# EAGLE design biertemp (EAGLE 6.5.0)
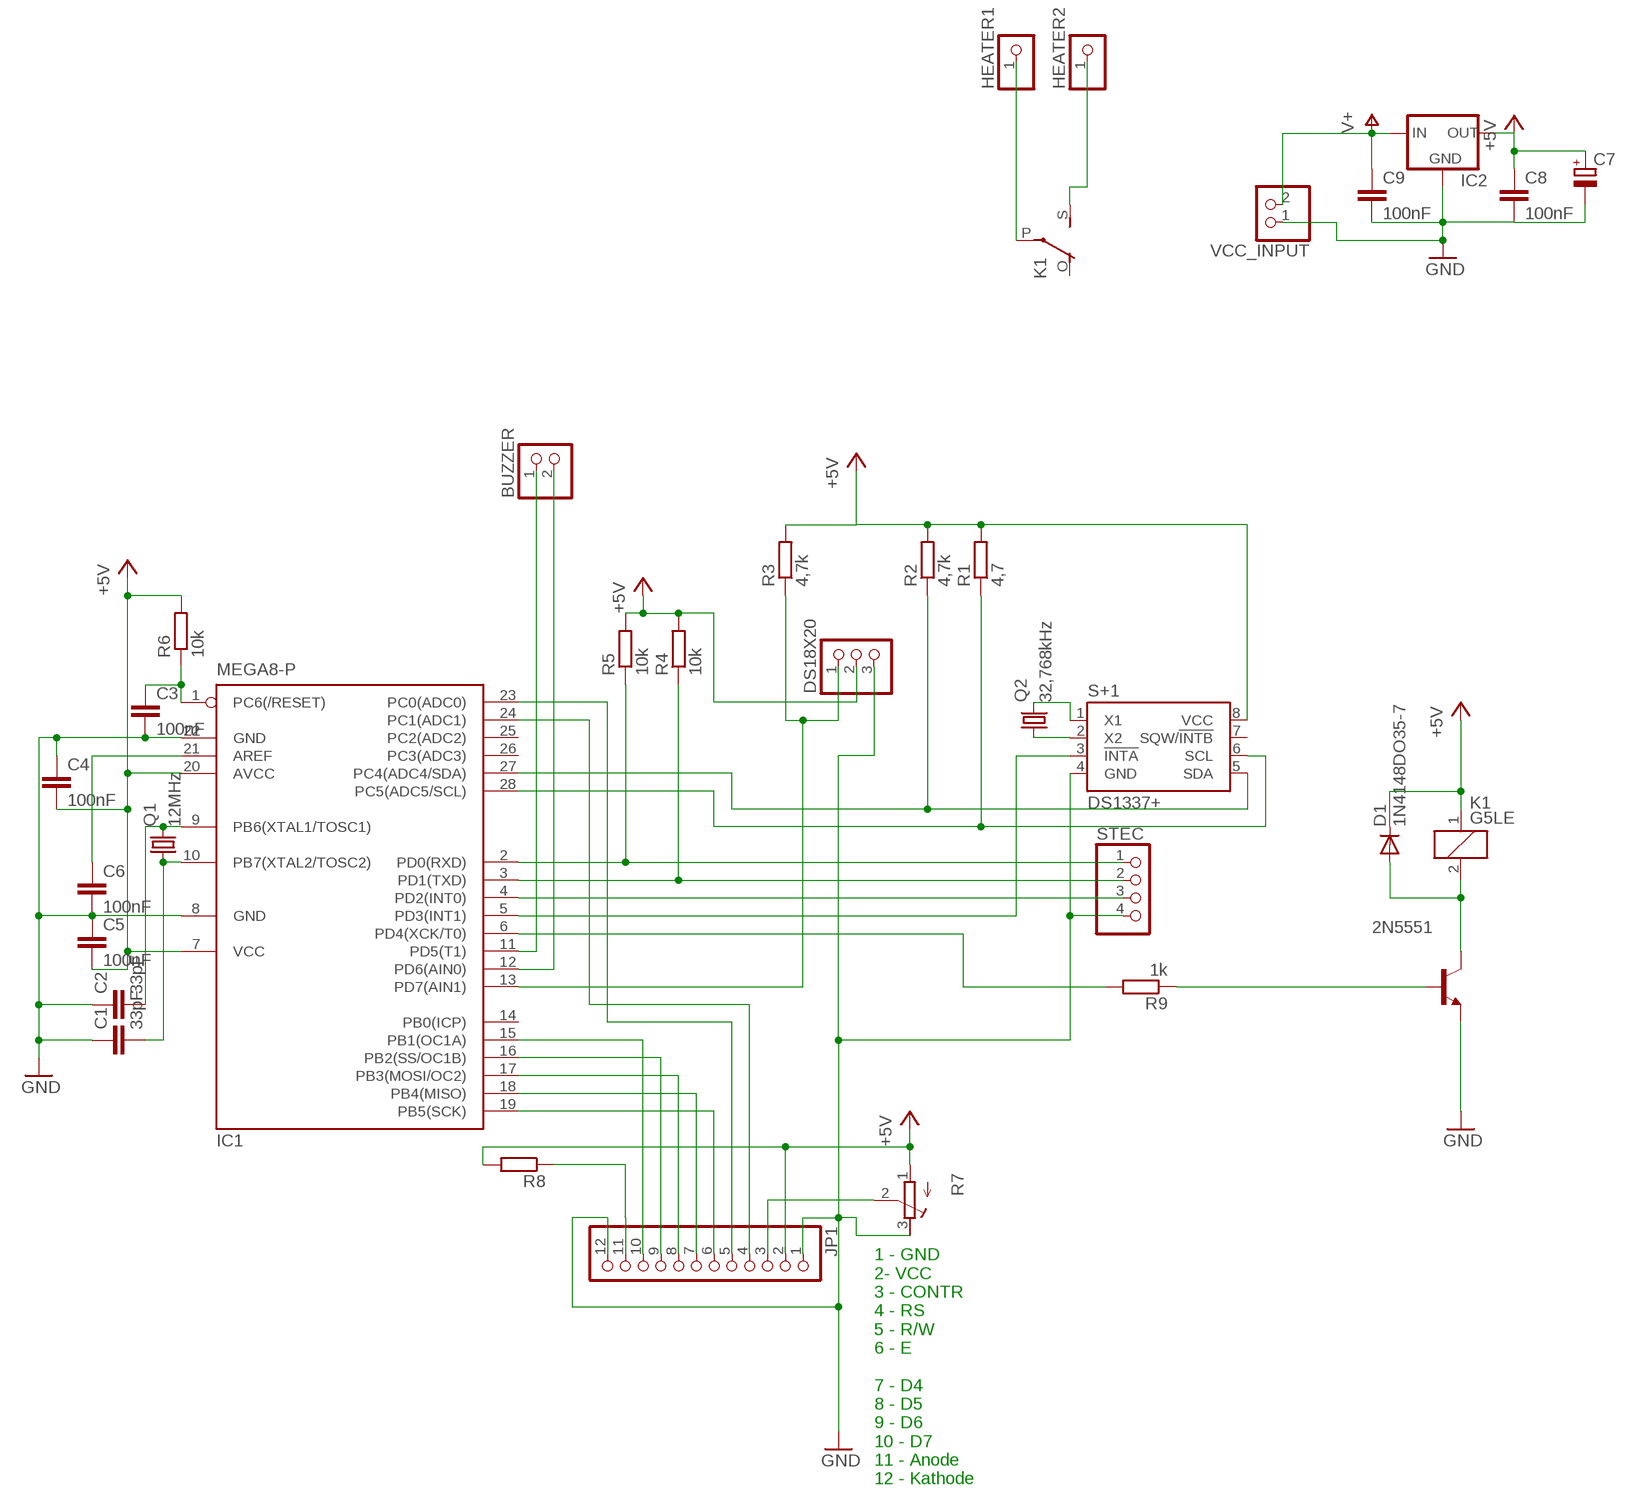
[diagram p0: schematic, sheet 1]

## Parts
2N5551  -NPN-TO92-EBC  [TO92-EBC]
BUZZER  PINHD-1X2  [1X02]
C1  33pF  C-EU025-024X044  [C025-024X044]
C2  33pF  C-EU025-024X044  [C025-024X044]
C3  100nF  C-EU025-024X044  [C025-024X044]
C4  100nF  C-EU025-024X044  [C025-024X044]
C5  100nF  C-EU025-024X044  [C025-024X044]
C6  100nF  C-EU025-024X044  [C025-024X044]
C7  CPOL-EUE5-8.5  [E5-8,5]
C8  100nF  C-EU025-024X044  [C025-024X044]
C9  100nF  C-EU025-024X044  [C025-024X044]
D1  1N4148DO35-7  [DO35-7]
DS18X20  PINHD-1X3  [1X03]
HEATER1  PINHD-1X1  [1X01]
HEATER2  PINHD-1X1  [1X01]
IC1  MEGA8-P  [DIL28-3]
IC2  78XXS  [78XXS]
JP1  PINHD-1X12  [1X12]
K1  G5LE  [G5LE]
Q1  12MHz  CRYSTALHC49S  [HC49/S]
Q2  32,768kHz  CRYSTALTC26V  [TC26V]
R1  4,7  R-EU_0204/7  [0204/7]
R2  4,7k  R-EU_0204/7  [0204/7]
R3  4,7k  R-EU_0204/7  [0204/7]
R4  10k  R-EU_0204/7  [0204/7]
R5  10k  R-EU_0204/7  [0204/7]
R6  10k  R-EU_0204/7  [0204/7]
R7  R-TRIMM64X  [RTRIM64X]
R8  R-EU_0204/7  [0204/7]
R9  1k  R-EU_0204/7  [0204/7]
S+1  DS1337+  [DIL8]
STEC  PINHD-1X4  [1X04]
VCC_INPUT  PINHD-1X2  [1X02]

## Nets
+5V: C4.2 C5.2 C7.+ C8.1 D1.C DS18X20.2 IC1.7(VCC) IC1.20(AVCC) IC2.OUT JP1.2 K1.1 R1.2 R2.2 R3.2 R4.2 R5.2 R6.2 R7.1(A) R8.2 S+1.8(VCC)
GND: 2N5551.E C1.1 C2.1 C3.2 C4.1 C5.1 C6.2 C7.- C8.2 C9.2 DS18X20.3 IC1.8(GND) IC1.22(GND) IC2.GND JP1.1 JP1.12 R7.3(E) S+1.4(GND) STEC.4 VCC_INPUT.1
N$1: IC1.4(PD2(INT0)) STEC.3
N$2: DS18X20.1 IC1.13(PD7(AIN1)) R3.1
N$3: C6.1 IC1.21(AREF)
N$4: Q2.1 S+1.2(X2)
N$5: C3.1 IC1.1(PC6(/RESET)) R6.1
N$6: C2.2 IC1.9(PB6(XTAL1/TOSC1)) Q1.2
N$7: C1.2 IC1.10(PB7(XTAL2/TOSC2)) Q1.1
N$8: IC1.6(PD4(XCK/T0)) R9.2
N$9: IC1.3(PD1(TXD)) R4.1 STEC.2
N$10: Q2.2 S+1.1(X1)
N$11: IC1.5(PD3(INT1)) S+1.3(!INTA)
N$12: IC1.27(PC4(ADC4/SDA)) R2.1 S+1.5(SDA)
N$13: IC1.28(PC5(ADC5/SCL)) R1.1 S+1.6(SCL)
N$14: IC1.15(PB1(OC1A)) JP1.10
N$15: JP1.11 R8.1
N$16: JP1.3 R7.2(S)
N$17: IC1.16(PB2(SS/OC1B)) JP1.9
N$18: IC1.17(PB3(MOSI/OC2)) JP1.8
N$19: IC1.18(PB4(MISO)) JP1.7
N$20: IC1.19(PB5(SCK)) JP1.6
N$21: IC1.23(PC0(ADC0)) JP1.5
N$22: IC1.24(PC1(ADC1)) JP1.4
N$24: BUZZER.1 IC1.11(PD5(T1))
N$25: IC1.2(PD0(RXD)) R5.1 STEC.1
N$26: BUZZER.2 IC1.12(PD6(AIN0))
N$27: 2N5551.B R9.1
N$28: 2N5551.C D1.A K1.2
N$31: HEATER1.1 K1.P(2:P)
N$32: HEATER2.1 K1.S(2:S)
V+: C9.1 IC2.IN VCC_INPUT.2
Unconnected: IC1.14(PB0(ICP)) IC1.25(PC2(ADC2)) IC1.26(PC3(ADC3)) K1.O(2:O) S+1.7(SQW/!INTB!)

## Notes on the sheet
- 1 - GND
  2- VCC
  3 - CONTR
  4 - RS
  5 - R/W
  6 - E
  
  7 - D4
  8 - D5
  9 - D6
  10 - D7
  11 - Anode
  12 - Kathode

## Library data of the parts
2N5551 = transistor:*-NPN-: NPN Transistror BF959 corrected 2008.03.06
BUZZER VCC_INPUT = pinhead:PINHD-1X2: PIN HEADER
C1-C6 C8 C9 = rcl:C-EU: CAPACITOR, European symbol
C7 = rcl:CPOL-EU: POLARIZED CAPACITOR, European symbol
D1 = diode:1N4148: DIODE high speed (Philips)
DS18X20 = pinhead:PINHD-1X3: PIN HEADER
HEATER1 HEATER2 = pinhead:PINHD-1X1: PIN HEADER
IC1 = atmel:MEGA8-P: MICROCONTROLLER 8 Kbytes FLASH, 1 kbytes SRAM, 512 bytes EEPROM, USART, 4-channel 10 bit ADC, 2-channel 8 bit ADC Pin compatible with Atmega48, ATMega88, ATMega168 Source: avr.lbr; OC_FARNELL: unknown; OC_NEWARK: unknown
IC2 = v-reg:78XXS: VOLTAGE REGULATOR
JP1 = pinhead:PINHD-1X12: PIN HEADER
K1 = relay:G5LE: RELAY 1 x switch, 10 A/120 V AC, 8 A/30 V DC, Omron; OC_FARNELL: unknown; OC_NEWARK: unknown
Q1 = crystal:CRYSTAL: CRYSTAL; OC_FARNELL: 1667008; OC_NEWARK: unknown
Q2 = crystal:CRYSTAL: CRYSTAL; OC_FARNELL: unknown; OC_NEWARK: unknown
R1-R6 R8 R9 = rcl:R-EU_: RESISTOR, European symbol
R7 = rcl:R-TRIMM: Trimm resistor
S+1 = eagle-library-edeca.net-v5:DS1337: DS1337 I2C serial real-time clock Low-power clock/calendar with two programmable time-of-day alarms and a programmable square-wave output. http://pdfserv.maxim-ic.com/en/ds/DS1337-DS1337C.pdf
STEC = pinhead:PINHD-1X4: PIN HEADER

## Board
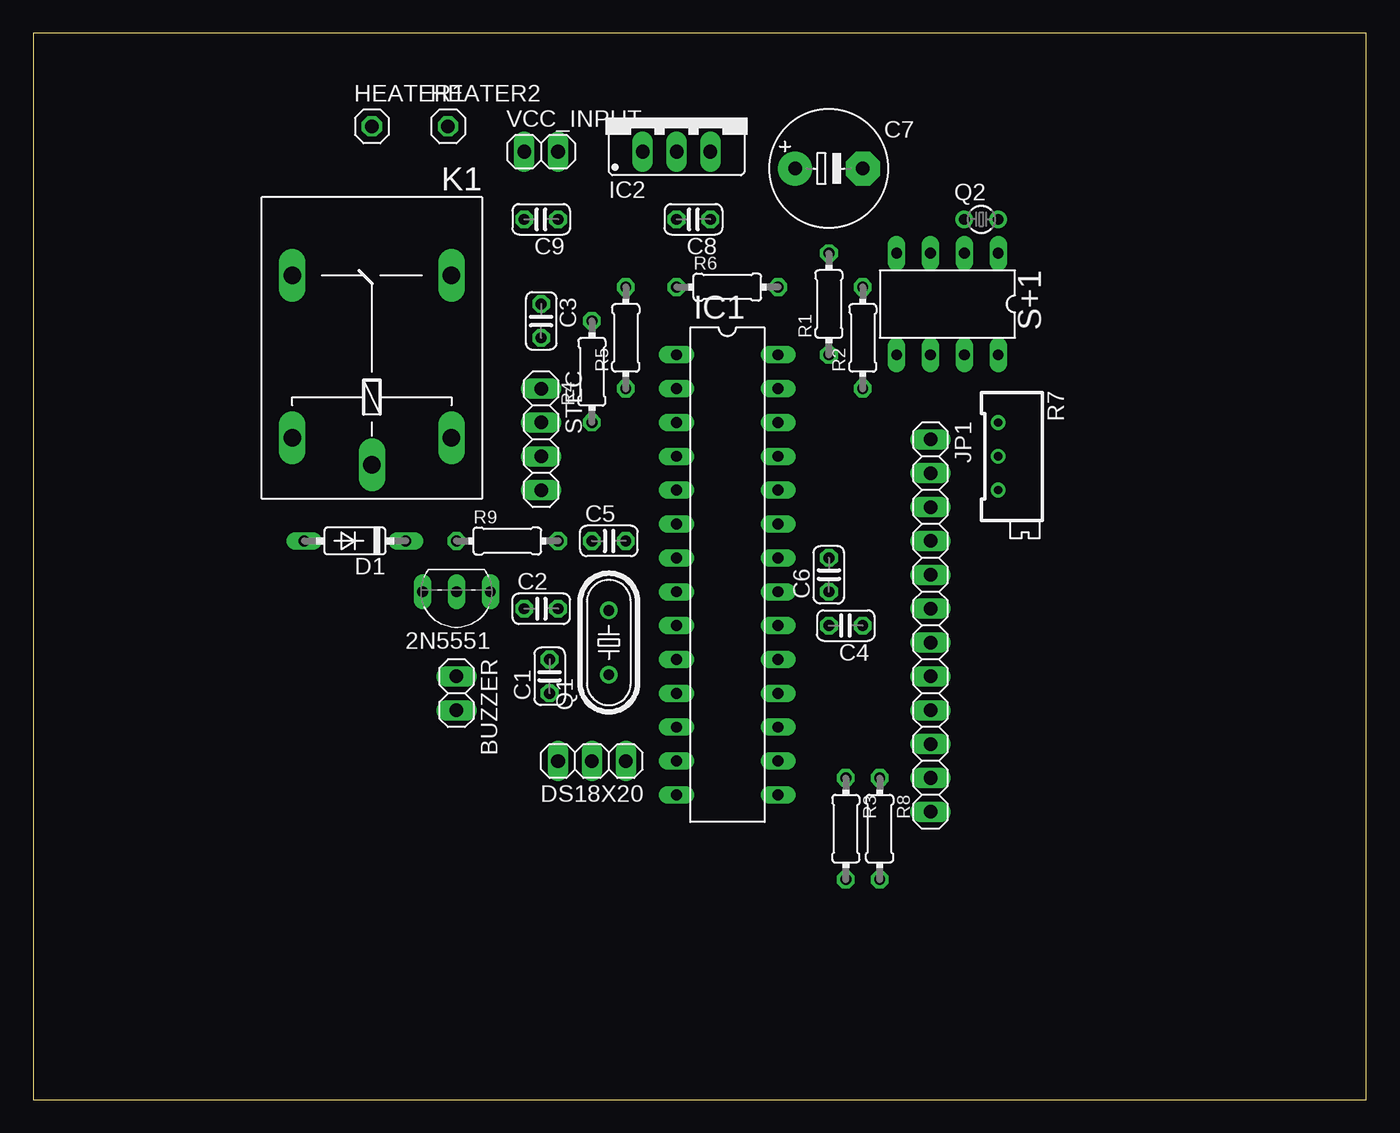
[diagram p1: board, top side]
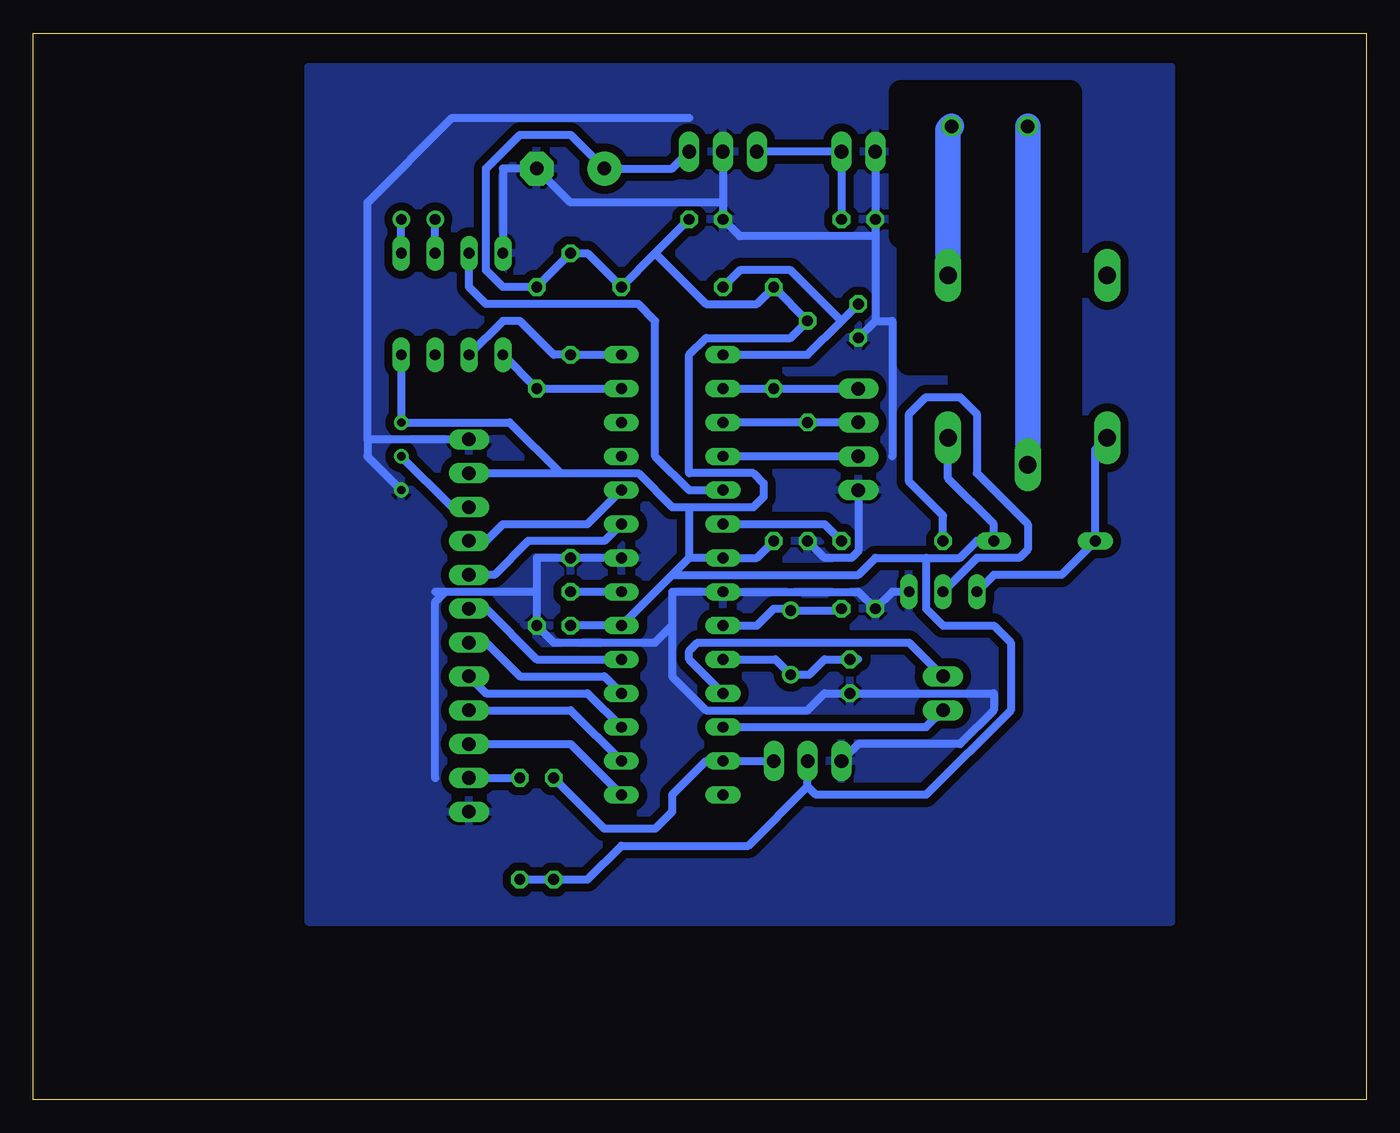
[diagram p2: board, bottom side, seen from below]

Size 100 x 80 mm. Coordinates in mm from the lower left corner, seen from the top.
Outline: 0,0 100,0 100,80 0,80 0,0
Copper layers (1*16): Top 0.035mm / dielectric 1.5mm / Bottom 0.035mm
Design rules "default *": minimum track width 10mil, minimum drill 24mil, track to track 8mil, track to pad 8mil, pad to pad 8mil, via to via 8mil, smd to smd 8mil, copper to edge 40mil, drill to drill 8mil, minimum pad ring 10mil, minimum via ring 8mil, stop-mask expansion 4mil, vias tented up to drill 0mil, thermal gap 10mil
bRestrict: area 22.2,43.8 to 34.9,75.6

### Footprints (pad centres in the part's own frame; a part is rotated, then mirrored left to right if it is on the bottom)
TO92-EBC = drill 0.813 long: B 0,-1.27; C 2.54,-1.27; E -2.54,-1.27
1X02 = drill 1.016 long: 1 -1.27,0; 2 1.27,0
C025-024X044 = drill 0.813 octagon: 1 -1.27,0; 2 1.27,0
E5-8,5 = drill 1.016 pad 2.54: + -2.54,0 | drill 1.016 pad 2.54 octagon: - 2.54,0
DO35-7 = drill 0.813 long: A 3.81,0; C -3.81,0
1X03 = drill 1.016 long: 1 -2.54,0; 2 0,0; 3 2.54,0
1X01 = drill 1.016 octagon: 1 0,0
DIL28-3 = drill 0.813 long: 1 -16.51,-3.81; 2 -13.97,-3.81; 3 -11.43,-3.81; 4 -8.89,-3.81; 5 -6.35,-3.81; 6 -3.81,-3.81; 7 -1.27,-3.81; 8 1.27,-3.81; 9 3.81,-3.81; 10 6.35,-3.81; 11 8.89,-3.81; 12 11.43,-3.81; 13 13.97,-3.81; 14 16.51,-3.81; 15 16.51,3.81; 16 13.97,3.81; 17 11.43,3.81; 18 8.89,3.81; 19 6.35,3.81; 20 3.81,3.81; 21 1.27,3.81; 22 -1.27,3.81; 23 -3.81,3.81; 24 -6.35,3.81; 25 -8.89,3.81; 26 -11.43,3.81; 27 -13.97,3.81; 28 -16.51,3.81
78XXS = drill 1.016 long: GND 0,-2.54; IN -2.54,-2.54; OUT 2.54,-2.54
1X12 = drill 1.016 long: 1 -13.97,0; 2 -11.43,0; 3 -8.89,0; 4 -6.35,0; 5 -3.81,0; 6 -1.27,0; 7 1.27,0; 8 3.81,0; 9 6.35,0; 10 8.89,0; 11 11.43,0; 12 13.97,0
G5LE = drill 1.321 long: 1 -7.493,-5.969; 2 -7.493,5.969; O 4.699,5.969; P -9.525,0; S 4.699,-5.969
HC49/S = drill 0.813: 1 -2.413,0; 2 2.413,0
TC26V = drill 0.813: 1 -1.27,0; 2 1.27,0
0204/7 = drill 0.813 octagon: 1 -3.81,0; 2 3.81,0
RTRIM64X = drill 0.61: 1 1.27,-2.54; 2 1.27,0; 3 1.27,2.54
DIL8 = drill 0.813 long: 1 -3.81,-3.81; 2 -1.27,-3.81; 3 1.27,-3.81; 4 3.81,-3.81; 5 3.81,3.81; 6 1.27,3.81; 7 -1.27,3.81; 8 -3.81,3.81
1X04 = drill 1.016 long: 1 -3.81,0; 2 -1.27,0; 3 1.27,0; 4 3.81,0

### Placement (x,y rotation side)
2N5551  31.75,36.83 180 top
BUZZER  31.75,30.48 270 top
C1  38.73,31.75 90 top
C2  38.1,36.83 0 top
C3  38.1,58.42 270 top
C4  60.96,35.56 180 top
C5  43.18,41.91 0 top
C6  59.69,39.37 90 top
C7  59.69,69.85 0 top
C8  49.53,66.04 180 top
C9  38.1,66.04 180 top
D1  24.13,41.91 180 top
DS18X20  41.91,25.4 180 top
HEATER1  25.4,73.03 0 top
HEATER2  31.11,73.03 0 top
IC1  52.07,39.37 270 top
IC2  48.26,73.66 0 top
JP1  67.31,35.56 270 top
K1  25.4,57.15 90 top
Q1  43.18,34.29 90 top
Q2  71.12,66.04 0 top
R1  59.69,59.69 90 top
R2  62.23,57.15 90 top
R3  60.96,20.32 270 top
R4  41.91,54.61 90 top
R5  44.45,57.15 90 top
R6  52.07,60.96 0 top
R7  73.66,48.26 180 top
R8  63.5,20.32 270 top
R9  35.56,41.91 0 top
S+1  68.58,59.69 180 top
STEC  38.1,49.53 270 top
VCC_INPUT  38.1,71.12 0 top

### Tracks (layer width: path | path; a pad name or v marks a point on that pad's centre or on a via)
+5V
  Bottom 0.61: C4.2 IC1.20 52.07,39.37 | C5.2 45.72,40.64 IC1.7 50.8,40.64 | IC2.OUT 52.07,69.85 C7.+ 59.69,72.39 63.5,72.39 66.04,69.85 66.04,62.23 64.77,60.96 R2.2 R1.2 58.42,63.5 R6.2 53.34,63.5 | 53.34,63.5 C8.1 | 53.34,63.5 49.53,59.69 45.72,59.69 R5.2 R4.2 43.18,57.15 49.53,57.15 50.8,55.88 50.8,46.99 45.97,46.99 45.21,46.23 45.21,45.21 45.97,44.45 50.8,44.45 | R8.2 R3.2 58.42,16.51 55.88,19.05 46.35,19.05 41.91,23.5 | 50.8,40.64 52.07,39.37 | S+1.8 R7.1 64.26,50.8 60.45,46.99 | 50.8,44.45 50.8,40.64 | 50.8,44.45 52.07,44.45 54.61,46.99 60.45,46.99 | JP1.2 60.45,46.99 | 33.02,40.64 36.83,40.64 38.1,39.37 52.07,39.37 | 33.02,40.64 30.48,40.64 29.21,41.91 D1.C 27.94,43.18 31.37,46.61 K1.1 | 33.02,40.64 33.02,36.83 31.75,35.56 27.94,35.56 26.67,34.29 26.67,29.21 33.02,22.86 41.27,22.86 41.91,23.5 | 41.91,23.5 DS18X20.2
GND
  Bottom 0.61: IC1.22 C6.2 62.23,40.64 62.23,38.1 | S+1.4 64.77,69.85 C7.- 59.69,67.31 48.26,67.31 | C5.1 40.64,40.64 38.61,40.64 38.1,41.15 STEC.4 | IC2.GND 48.26,67.31 | 48.26,67.31 C8.2 46.99,64.77 36.83,64.77 | 36.83,58.42 C3.2 | 36.83,64.77 C9.2 VCC_INPUT.1 | 36.83,64.77 36.83,58.42 | 35.56,48.26 35.56,58.42 36.83,58.42 | 2N5551.E 35.56,38.1 C2.1 38.1,38.1 IC1.8 52.07,38.1 52.07,35.56 | 52.07,35.56 52.07,31.75 49.53,29.21 41.91,29.21 40.64,30.48 C1.1 27.94,30.48 27.94,29.21 30.48,26.67 38.1,26.67 DS18X20.3 | R7.3 74.93,48.26 74.93,49.53 | JP1.1 74.93,49.53 | 62.23,38.1 C4.1 60.96,34.29 53.34,34.29 52.07,35.56 | 62.23,38.1 69.09,38.1 | 69.09,38.1 69.85,38.1 | 50.8,73.66 68.58,73.66 74.93,67.31 74.93,49.53 | 69.85,24.13 69.85,37.34 69.09,38.1
  pour Bottom (isolate 0.61): 14.61,77.47 79.38,77.47 79.38,13.34 14.61,13.34
N$1
  Bottom 0.61: STEC.3 IC1.4
N$2
  Bottom 0.61: DS18X20.1 IC1.13 49.53,25.4 52.07,22.86 52.07,21.59 53.34,20.32 57.15,20.32 R3.1
N$3
  Bottom 0.61: IC1.21 C6.1
N$4
  Bottom 0.61: S+1.2 Q2.1
N$5
  Bottom 0.61: 39.37,58.42 41.91,55.88 IC1.1 | 39.37,58.42 C3.1 | R6.1 46.99,62.23 43.18,62.23 39.37,58.42
N$6
  Bottom 0.61: IC1.9 45.72,35.56 44.45,36.83 43.31,36.83 Q1.2 39.5,36.7 C2.2
N$7
  Bottom 0.61: IC1.10 44.32,33.02 Q1.1 41.78,31.88 40.64,33.02 C1.2 38.1,33.02
N$8
  Bottom 0.61: R9.2 40.64,43.18 IC1.6
N$9
  Bottom 0.61: STEC.2 R4.1 IC1.3
N$10
  Bottom 0.61: S+1.1 Q2.2
N$11
  Bottom 0.61: S+1.3 67.31,60.96 66.04,59.69 54.61,59.69 53.34,58.42 53.34,48.26 50.8,45.72 IC1.5
N$12
  Bottom 0.61: IC1.27 R2.1 S+1.5
N$13
  Bottom 0.61: IC1.28 R1.1 60.96,55.88 63.5,58.42 64.77,58.42 S+1.6
N$14
  Bottom 0.61: IC1.15 59.69,26.67 JP1.10
N$15
  Bottom 0.61: JP1.11 R8.1
N$16
  Bottom 0.61: R7.2 68.58,44.45 JP1.3
N$17
  Bottom 0.61: IC1.16 59.69,29.21 JP1.9
N$18
  Bottom 0.61: IC1.17 58.42,30.48 66.04,30.48 JP1.8
N$19
  Bottom 0.61: JP1.7 66.04,34.29 63.5,31.75 57.15,31.75 IC1.18
N$20
  Bottom 0.61: IC1.19 62.23,33.02 66.04,36.83 JP1.6
N$21
  Bottom 0.61: IC1.23 57.15,41.91 62.87,41.91 65.41,39.37 JP1.5 66.04,39.37
N$22
  Bottom 0.61: IC1.24 58.42,43.18 64.77,43.18 66.04,41.91 JP1.4
N$24
  Bottom 0.61: IC1.11 50.8,33.02 50.8,33.66 50.16,34.29 34.29,34.29 BUZZER.1
N$25
  Bottom 0.61: IC1.2 R5.1 STEC.1
N$26
  Bottom 0.61: IC1.12 33.02,27.94 BUZZER.2
N$27
  Bottom 0.61: R9.1 31.75,43.81 34.29,46.35 34.29,51.44 33.02,52.7 30.48,52.7 29.21,51.44 29.21,46.99 25.4,43.18 25.4,41.27 26.04,40.64 29.21,40.64 2N5551.B
N$28
  Bottom 0.61: 2N5551.C 27.94,39.37 22.86,39.37 D1.A 20.32,48.77 K1.2
N$31
  Bottom 1.93: K1.P HEATER1.1
N$32
  Bottom 1.93: K1.S 31.37,72.77 HEATER2.1
V+
  Bottom 0.61: C9.1 VCC_INPUT.2 IC2.IN